# EasyEDA schematic SCH_miliohn_V.1_2026-03-07.json
TITLE: Sheet_1; REV: 1.0; Date: 2026-02-22; Sheet: 1/1; Drawn By: richararaque09; Company: Your Company
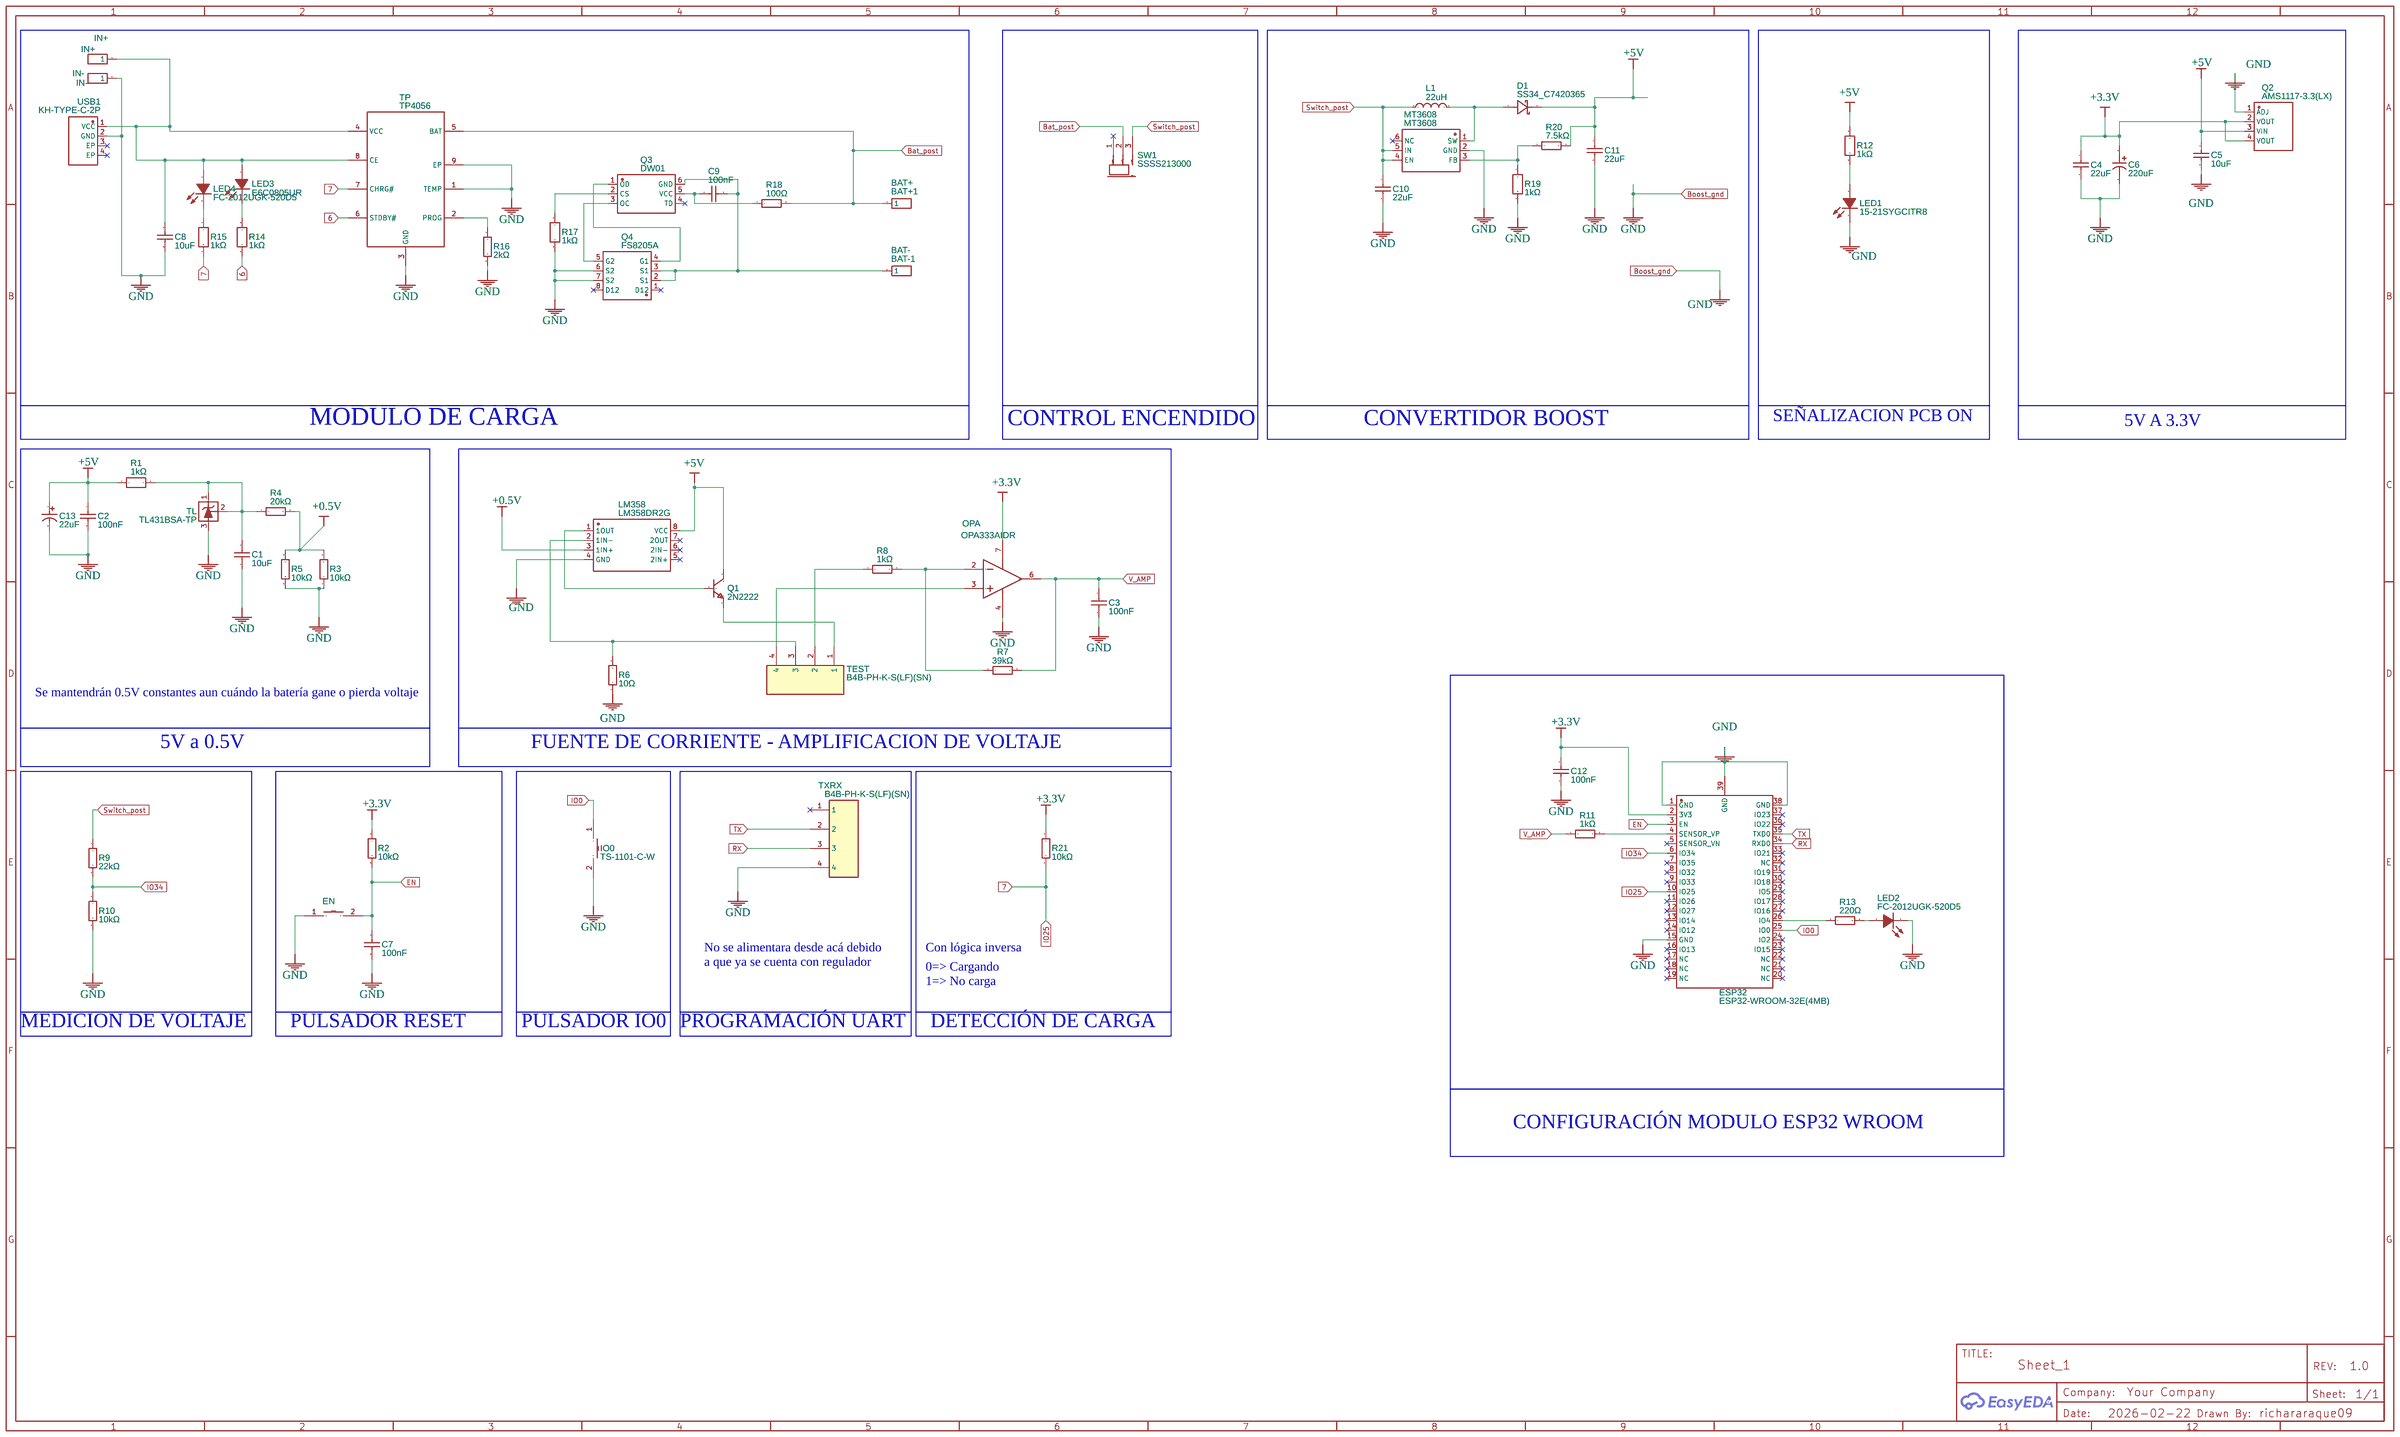
[diagram p0: schematic sheet]

## Parts
BAT+  BAT+1  [HDR-M-2.54_1X1]
BAT-  BAT-1  [HDR-M-2.54_1X1]
C1  10uF  [C1206]
C2  100nF  [C1206]
C3  100nF  [C1206]
C4  22uF  [C1206]
C5  10uF  [C1206]
C6  220uF  [CAP-SMD_BD6.3-L6.6-W6.6-LS7.2-FD]
C7  100nF  [C1206]
C8  10uF  [C1206]
C9  100nF  [C1206]
C10  22uF  [C1206]
C11  22uF  [C1206]
C12  100nF  [C1206]
C13  22uF  [CAP-SMD_BD4.0-L4.3-W4.3-FD-LS5.3]
D1  SS34_C7420365  [SMA_L4.3-W2.6-LS5.0-FD]
EN  EN  [SW-SMD_L6.0-W3.3-LS8.0]
ESP32  ESP32-WROOM-32E(4MB)  [WIFI-SMD_ESP32-WROOM-32E]
IN+  IN+  [HDR-M-2.54_1X1]
IN-  IN-  [HDR-M-2.54_1X1]
IO0  TS-1101-C-W  [SW-SMD_L6.0-W3.3-LS8.0]
L1  22uH  [IND-SMD_L3.5-W3.0]
LED1  15-21SYGCITR8  [LED1206-RD_YELLOW-1]
LED2  FC-2012UGK-520D5  [LED0805-R-RD]
LED3  E6C0805UR  [LED0805-R-RD]
LED4  FC-2012UGK-520D5  [LED0805-R-RD]
LM358  LM358DR2G  [SOIC-8_L5.0-W4.0-P1.27-LS6.0-BL]
MT3608  MT3608  [SOT-23-6_L2.9-W1.6-P0.95-LS2.8-BL]
OPA  OPA333AIDR  [SOIC-8_L5.0-W4.0-P1.27-LS6.0-BL]
Q1  2N2222  [TO-92-3_L4.9-W3.7-P1.27-L]
Q2  AMS1117-3.3(LX)  [SOT-223-3_L6.5-W3.4-P2.30-LS7.0-BR]
Q3  DW01  [SOT-23-6_L2.9-W1.6-P0.95-LS2.8-BR]
Q4  FS8205A  [TSSOP-8_L4.4-W3.0-P0.65-LS6.4-BL-2]
R1  1kΩ  [R1206]
R2  10kΩ  [R1206]
R3  10kΩ  [R1206]
R4  20kΩ  [R0805]
R5  10kΩ  [R1206]
R6  10Ω  [R1206]
R7  39kΩ  [R1206]
R8  1kΩ  [R1206]
R9  22kΩ  [R1206]
R10  10kΩ  [R1206]
R11  1kΩ  [R1206]
R12  1kΩ  [R1206]
R13  220Ω  [R1206]
R14  1kΩ  [R1206]
R15  1kΩ  [R1206]
R16  2kΩ  [R0805]
R17  1kΩ  [R1206]
R18  100Ω  [R0805]
R19  1kΩ  [R1206]
R20  7.5kΩ  [R0805]
R21  10kΩ  [R1206]
SW1  SSSS213000  [SW-TH_SSSS213000]
TEST  B4B-PH-K-S(LF)(SN)  [CONN-TH_B4B-PH-K-S]
TL  TL431BSA-TP  [SOT-23-3_L2.9-W1.3-P1.90-LS2.4-BR]
TP  TP4056  [ESOP-8_L4.9-W3.9-P1.27-LS6.0-BL-EP]
TXRX  B4B-PH-K-S(LF)(SN)  [CONN-TH_B4B-PH-K-S]
USB1  KH-TYPE-C-2P  [USB-SMD_KH-TYPE-C-2P]

## Library data of the parts
BAT+ BAT- IN+ IN- = HDR-M-2.54_1x1: Supplier Part: C81276; Supplier: LCSC; Contributor: LCEDA_Lib
C1 C5 C8 = CL31A106KBHNNNE: Supplier: LCSC; Manufacturer: SAMSUNG(三星); Supplier Part: C13585; JLCPCB Part Class: Basic Part
C2 C3 C7 C9 C12 = CL31B104KBCNNNC: Supplier: LCSC; Manufacturer: SAMSUNG(三星); Supplier Part: C24497; JLCPCB Part Class: Basic Part
C4 C10 C11 = 1206X226K100NT: Supplier: LCSC; Manufacturer: FH(风华); Supplier Part: C1859; JLCPCB Part Class: Extended Part
C6 = RVT1C221M0607 220UF 16V: Supplier: LCSC; Supplier Part: C970695; Manufacturer: DMBJ(振宝佳); JLCPCB Part Class: Extended Part; Contributor: lcsc
C13 = RVT1C220M0405_C3356: Supplier: LCSC; Manufacturer: HONOR(荣誉); Manufacturer Part: RVT1C220M0405; Supplier Part: C3356; JLCPCB Part Class: Extended Part
D1 = SS34_C7420365: Supplier: LCSC; Supplier Part: C7420365; Manufacturer: R+O(宏嘉诚); Manufacturer Part: SS34; Contributor: lcsc; JLCPCB Part Class: Extended Part
EN IO0 = TS-1101-C-W: Contributor: LCSC; Supplier: LCSC; Supplier Part: C318938; Manufacturer: XKB Connectivity(中国星坤); JLCPCB Part Class: Extended Part
ESP32 = ESP32-WROOM-32E(4MB): Contributor: LCSC; Supplier: LCSC; Supplier Part: C701341; Manufacturer: ESPRESSIF(乐鑫); Manufacturer Part: ESP32-WROOM-32E-N4; JLCPCB Part Class: Extended Part
L1 = CD32-220K: Supplier: LCSC; Supplier Part: C7588973; Manufacturer: ceaiya(柯爱亚); JLCPCB Part Class: Extended Part; Contributor: lcsc
LED1 = 15-21SYGCITR8: Supplier: LCSC; Manufacturer: KENTO; Manufacturer Part: KT-1206Y; Supplier Part: C2298; JLCPCB Part Class: Extended Part
LED2 LED4 = FC-2012UGK-520D5: Supplier: LCSC; Manufacturer: 国星光电; Manufacturer Part: NCD0805G1; Supplier Part: C84260; JLCPCB Part Class: Extended Part
LED3 = E6C0805UR: Supplier: LCSC; Manufacturer: KENTO; Manufacturer Part: KT-0805R; Supplier Part: C2295; JLCPCB Part Class: Extended Part
LM358 = LM358DR2G: Supplier: LCSC; Manufacturer: onsemi(安森美); Supplier Part: C7950; JLCPCB Part Class: Basic Part
MT3608 = MT3608: Supplier: LCSC; Manufacturer: 西安航天民芯; Supplier Part: C84817; JLCPCB Part Class: Extended Part
OPA = OPA333AIDR: tags: Precision Operational Amplifier; subpart_no: 1; image: http://image.lceda.cn/szlcsc/C13717.jpg; Supplier Part: C13717; Supplier: LCSC; Manufacturer: TI(德州仪器); JLCPCB Part Class: Extended Part
Q1 = 2N2222: Contributor: LCSC; Supplier: LCSC; Manufacturer: ST(先科); Manufacturer Part: 2N2222A; Supplier Part: C118536; JLCPCB Part Class: Extended Part
Q2 = AMS1117-3.3(LX): Supplier: LCSC; Supplier Part: C24833654; Manufacturer: LX(灵星芯微); JLCPCB Part Class: Extended Part; Contributor: lcsc
Q3 = DW01: Contributor: LCSC; Supplier: LCSC; Manufacturer: Hottech(合科泰); Supplier Part: C181096; JLCPCB Part Class: Extended Part
Q4 = FS8205A: Supplier: LCSC; Manufacturer: FORTUNE(富晶); Supplier Part: C16052; JLCPCB Part Class: Extended Part
R1 R12 R14 R15 R17 R19 = SCR1206J1K: Contributor: lcsc; Supplier: LCSC; Supplier Part: C3018015; Manufacturer: VO(翔胜); JLCPCB Part Class: Extended Part
R2 R3 R5 R10 R21 = 1206W4F1002T5E: Supplier: LCSC; Manufacturer: UNI-ROYAL(厚声); Supplier Part: C17902; JLCPCB Part Class: Basic Part
R4 = 0805W8F2002T5E: Supplier: LCSC; Manufacturer: UNI-ROYAL(厚声); Supplier Part: C4328; JLCPCB Part Class: Basic Part
R6 = 1206W4F100JT5E: Supplier: LCSC; Manufacturer: UNI-ROYAL(厚声); Supplier Part: C17903; JLCPCB Part Class: Basic Part
R7 = 1206W4F3902T5E: Supplier: LCSC; Manufacturer: UNI-ROYAL(厚声); Supplier Part: C18008; JLCPCB Part Class: Extended Part
R8 R11 = 1206W4J0102T5E: Supplier: LCSC; Manufacturer: UNI-ROYAL(厚声); Supplier Part: C1469; JLCPCB Part Class: Extended Part
R9 = 1206W4F2202T5E: Supplier: LCSC; Manufacturer: UNI-ROYAL(厚声); Supplier Part: C25830; JLCPCB Part Class: Extended Part
R13 = 1206W4F2200T5E: Supplier: LCSC; Manufacturer: UNI-ROYAL(厚声); Supplier Part: C17957; JLCPCB Part Class: Extended Part
R16 = 0805W8J0202T5E: Supplier: LCSC; Manufacturer: UNI-ROYAL(厚声); Supplier Part: C1359; JLCPCB Part Class: Extended Part
R18 = 0805W8F1000T5E: Supplier: LCSC; Manufacturer: UNI-ROYAL(厚声); Supplier Part: C17408; JLCPCB Part Class: Basic Part
R20 = 0805W8F7501T5E: Supplier: LCSC; Manufacturer: UNI-ROYAL(厚声); Supplier Part: C17807; JLCPCB Part Class: Extended Part
SW1 = SSSS213000: Contributor: LCSC; Supplier: LCSC; Manufacturer: ALPSALPINE(阿尔卑斯阿尔派); Supplier Part: C125054; JLCPCB Part Class: Extended Part
TEST TXRX = B4B-PH-K-S(LF)(SN): Contributor: LCSC; Supplier: LCSC; Manufacturer: JST; Supplier Part: C131334; JLCPCB Part Class: Extended Part
TL = TL431BSA-TP: Supplier: LCSC; Supplier Part: C48586693; Manufacturer: TECH PUBLIC(台舟); Contributor: lcsc; JLCPCB Part Class: Extended Part
TP = TP4056: Contributor: Guest; Supplier: LCSC; Manufacturer: TOPPOWER(南京拓微); Manufacturer Part: TP4056-42-ESOP8; Supplier Part: C16581; JLCPCB Part Class: Extended Part
USB1 = KH-TYPE-C-2P: Contributor: LCSC; Supplier: LCSC; Supplier Part: C2919656; Manufacturer: kinghelm(金航标); JLCPCB Part Class: Extended Part

## Nets
+0.5V: LM358.3(1IN+) R3.2 R4.2 R5.1
+3.3V: C4.1 C6.1 C12.1 ESP32.2(3V3) OPA.7(V+) Q2.2(VOUT) Q2.4(VOUT) R2.1 R21.2
+5V: C2.1 C5.1 C11.1 C13.1 D1.2(K) LM358.8(VCC) Q1.3(C) Q2.3(VIN) R1.1 R12.2 R20.2
6: R14.2 TP.6(STDBY#)
7: ESP32.10(IO25) R15.2 R21.1 TP.7(CHRG#)
Bat_post: BAT+.1 R18.2 SW1.2 TP.5(BAT)
Boost_gnd: C1.2 C2.2 C3.2 C4.2 C5.2 C6.2 C7.2 C8.2 C10.2 C11.2 C12.2 C13.2 EN.1 ESP32.1(GND) ESP32.15(GND) ESP32.38(GND) ESP32.39(GND) IN-.1 IO0.2 LED1.1(-) LED2.2(K) LM358.4(GND) MT3608.2(GND) OPA.4(V-) Q2.1(ADJ) Q4.6(S2) Q4.7(S2) R3.1 R5.2 R6.1 R10.2 R16.2 R17.2 R19.2 TL.3(A) TP.1(TEMP) TP.3(GND) TP.9(EP) TXRX.4 USB1.2(GND)
EN: C7.1 EN.2 ESP32.3(EN) R2.2
IO0: ESP32.25(IO0) IO0.1
IO34: ESP32.6(IO34) R9.2 R10.1
RX: ESP32.34(RXD0) TXRX.3
Switch_post: C10.1 L1.2 MT3608.4(EN) MT3608.5(IN) R9.1 SW1.3
TX: ESP32.35(TXD0) TXRX.2
V_AMP: C3.1 OPA.6(OUT) R7.2 R11.1
Net-(BAT--1): BAT-.1 C9.2 Q3.6(GND) Q4.2(S1) Q4.3(S1)
Net-(C1-1): C1.1 R1.2 R4.1 TL.1(K) TL.2(REF)
Net-(C8-1): C8.1 IN+.1 LED3.1(A) LED4.1(A) TP.4(VCC) TP.8(CE) USB1.1(VCC)
Net-(C9-1): C9.1 Q3.5(VCC) R18.1
Net-(D1-1): D1.1(A) L1.1 MT3608.1(SW)
Net-(ESP32-4): ESP32.4(SENSOR_VP) R11.2
Net-(ESP32-26): ESP32.26(IO4) R13.1
Net-(LED1-2): LED1.2(+) R12.1
Net-(LED2-1): LED2.1(A) R13.2
Net-(LED3-2): LED3.2(K) R14.1
Net-(LED4-2): LED4.2(K) R15.1
Net-(LM358-1): LM358.1(1OUT) Q1.2(B)
Net-(LM358-2): LM358.2(1IN-) R6.2 TEST.3
Net-(MT3608-3): MT3608.3(FB) R19.1 R20.1
Net-(OPA-2): OPA.2(IN-) R7.1 R8.2
Net-(OPA-3): OPA.3(IN+) TEST.4
Net-(Q1-1): Q1.1(E) TEST.1
Net-(Q3-1): Q3.1(OD) Q4.4(G1)
Net-(Q3-2): Q3.2(CS) R17.1
Net-(Q3-3): Q3.3(OC) Q4.5(G2)
Net-(R8-1): R8.1 TEST.2
Net-(R16-1): R16.1 TP.2(PROG)

Not connected (* = marked no-connect by the designer): ESP32 5(SENSOR_VN)* 7(IO35)* 8(IO32)* 9(IO33)* 11(IO26)* 12(IO27)* 13(IO14)* 14(IO12)* 16(IO13)* 17(NC)* 18(NC)* 19(NC)* 20(NC)* 21(NC)* 22(NC)* 23(IO15)* 24(IO2)* 27(IO16)* 28(IO17)* 29(IO5)* 30(IO18)* 31(IO19)* 32(NC)* 33(IO21)* 36(IO22)* 37(IO23)*; LM358 5(2IN+)* 6(2IN-)* 7(2OUT)*; MT3608 6(NC)*; Q3 4(TD)*; Q4 1(D12)* 8(D12)*; SW1 1*; TXRX 1*; USB1 3(EP)* 4(EP)*

## Notes on the sheet
- MODULO DE CARGA
- CONTROL ENCENDIDO
- CONVERTIDOR BOOST
- SEÑALIZACION PCB ON
- 5V A 3.3V
- Se mantendrán 0.5V constantes aun cuándo la batería gane o pierda voltaje
- 5V a 0.5V
- FUENTE DE CORRIENTE - AMPLIFICACION DE VOLTAJE
- No se alimentara desde acá debido
- Con lógica inversa
- a que ya se cuenta con regulador
- 0=> Cargando
- 1=> No carga
- MEDICION DE VOLTAJE
- PULSADOR RESET
- PULSADOR IO0
- PROGRAMACIÓN UART
- DETECCIÓN DE CARGA
- CONFIGURACIÓN MODULO ESP32 WROOM
